# EAGLE design PaxGeo_MoBo (EAGLE 7.2.0)
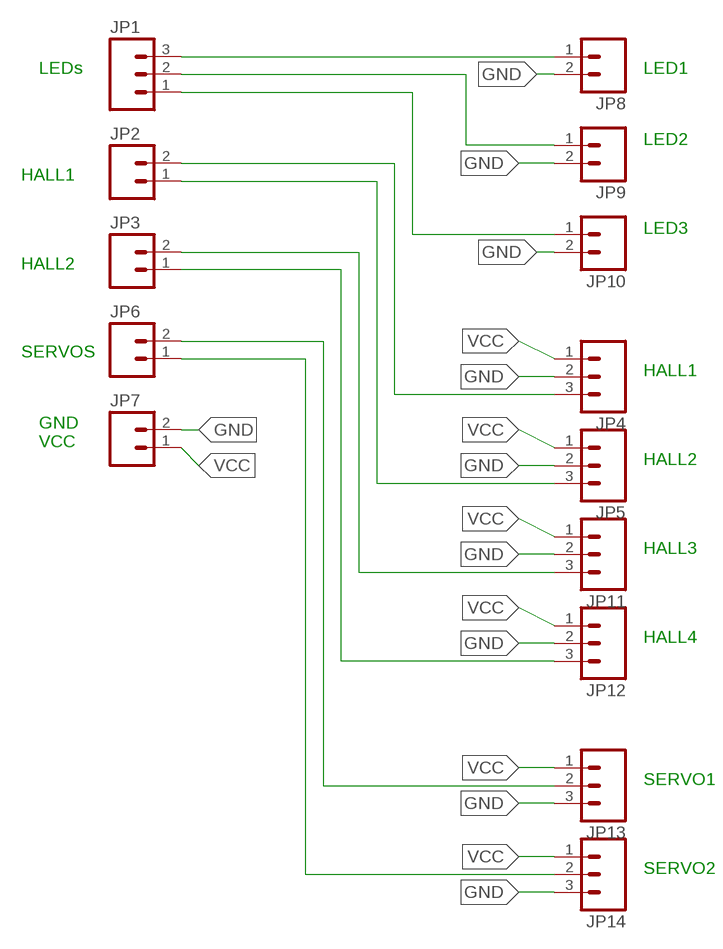
[diagram p0: schematic, sheet 1]

## Parts
JP1  M03SCREW  [SCREWTERMINAL-3.5MM-3]
JP2  M023.5MM  [SCREWTERMINAL-3.5MM-2]
JP3  M023.5MM  [SCREWTERMINAL-3.5MM-2]
JP4  M03SCREW  [SCREWTERMINAL-3.5MM-3]
JP5  M03SCREW  [SCREWTERMINAL-3.5MM-3]
JP6  M023.5MM  [SCREWTERMINAL-3.5MM-2]
JP7  M023.5MM  [SCREWTERMINAL-3.5MM-2]
JP8  M023.5MM  [SCREWTERMINAL-3.5MM-2]
JP9  M023.5MM  [SCREWTERMINAL-3.5MM-2]
JP10  M023.5MM  [SCREWTERMINAL-3.5MM-2]
JP11  M03SCREW  [SCREWTERMINAL-3.5MM-3]
JP12  M03SCREW  [SCREWTERMINAL-3.5MM-3]
JP13  M03SCREW  [SCREWTERMINAL-3.5MM-3]
JP14  M03SCREW  [SCREWTERMINAL-3.5MM-3]

## Nets
GND: JP4.2 JP5.2 JP7.2 JP8.2 JP9.2 JP10.2 JP11.2 JP12.2 JP13.3 JP14.3
N$1: JP1.3 JP8.1
N$2: JP1.2 JP9.1
N$3: JP1.1 JP10.1
N$4: JP2.2 JP4.3
N$5: JP2.1 JP5.3
N$6: JP3.2 JP11.3
N$7: JP3.1 JP12.3
N$8: JP6.2 JP13.2
N$9: JP6.1 JP14.2
VCC: JP4.1 JP5.1 JP7.1 JP11.1 JP12.1 JP13.1 JP14.1

## Notes on the sheet
- LEDs | LED1
- LED2
- HALL1
- LED3
- HALL2
- SERVOS | HALL1
- GND | VCC
- HALL2
- HALL3
- HALL4
- SERVO1
- SERVO2

## Library data of the parts
JP1 JP4 JP5 JP11-JP14 = SparkFun-Connectors:M03: Header 3 Standard 3-pin 0.1" header. Use with straight break away headers (SKU : PRT-00116), right angle break away headers (PRT-00553), swiss pins (PRT-00743), machine pins (PRT-00117), and female headers (PRT-00115). Molex polarized connector foot print use with SKU : PRT-08232 with associated crimp pins and housings.; PROD_ID: CONN-08288
JP2 JP3 JP6-JP10 = SparkFun-Connectors:M02: Standard 2-pin 0.1" header. Use with - straight break away headers ( PRT-00116) - right angle break away headers (PRT-00553) - swiss pins (PRT-00743) - machine pins (PRT-00117) - female headers (PRT-00115) Molex polarized connector foot print use with: PRT-08233 with associated crimp pins and housings. 2.54_SCREWTERM for use with PRT-10571. 3.5mm Screw Terminal footprints for PRT-08084 5mm Screw Terminal footprints for use with PRT-08432; PROD_ID: CONN-08399

## Board
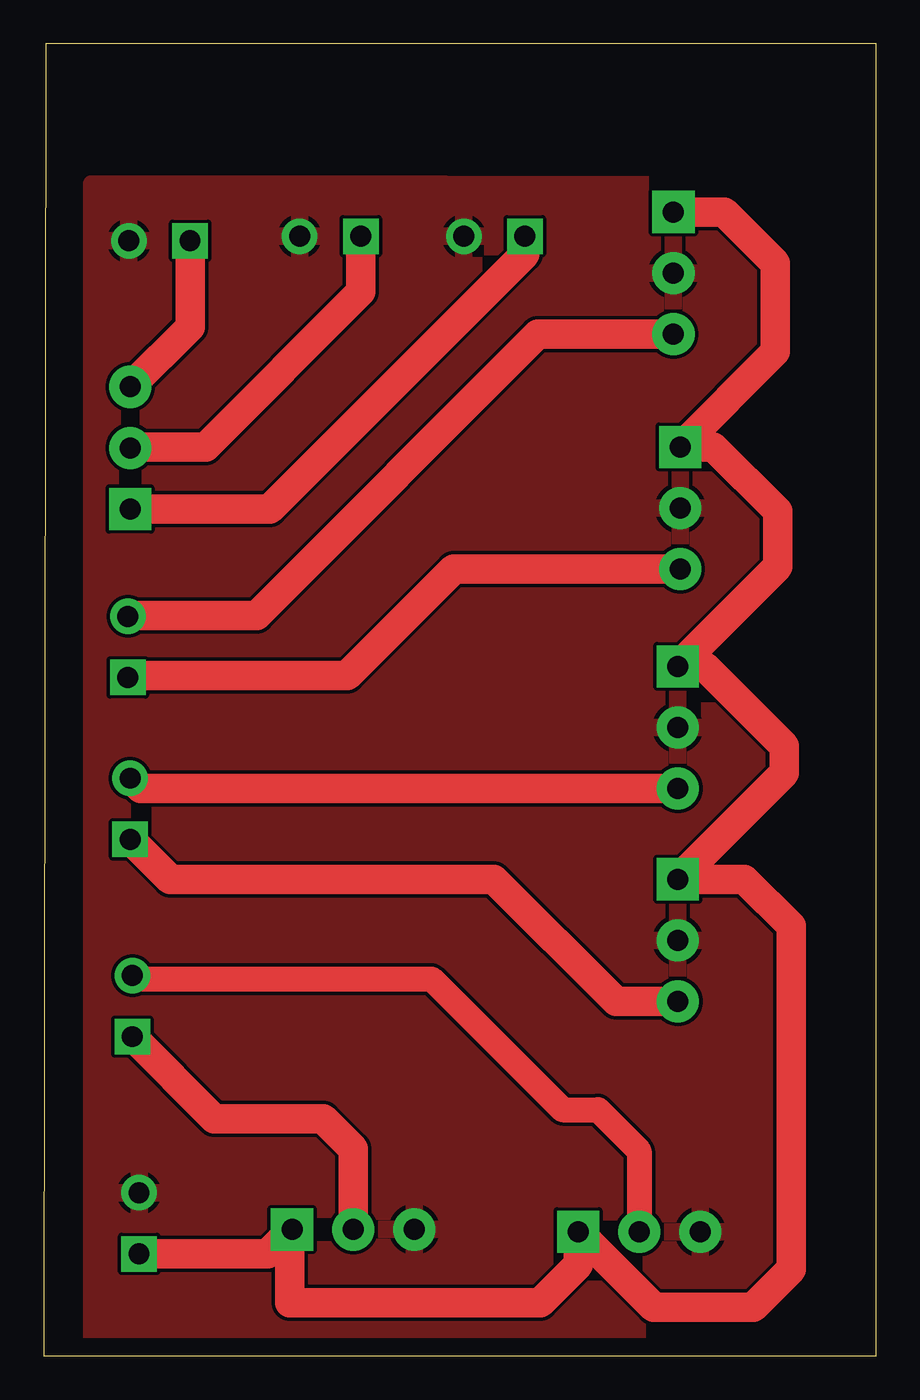
[diagram p1: board, top side]
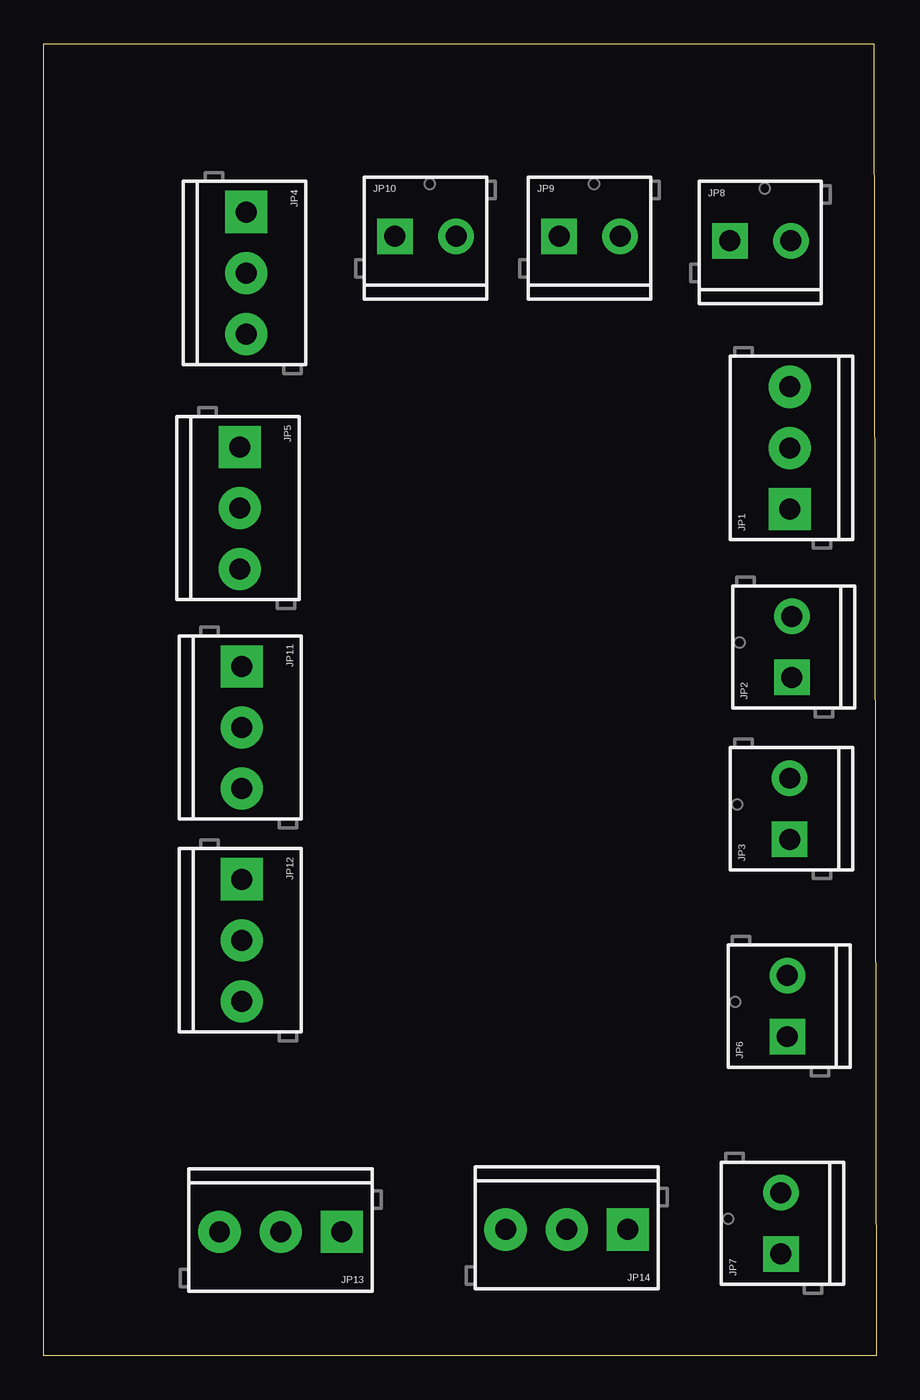
[diagram p2: board, bottom side, seen from below]

Size 47.68 x 75.17 mm. Coordinates in mm from the lower left corner, seen from the top.
Outline: 0,0 47.68,0 47.68,75.17 0.13,75.17 0,0
Copper layers (1*16): Top 0.035mm / dielectric 1.5mm / Bottom 0.035mm
Design rules "default": minimum track width 10mil, minimum drill 24mil, track to track 8mil, track to pad 8mil, pad to pad 8mil, via to via 8mil, smd to smd 8mil, copper to edge 40mil, drill to drill 8mil, minimum pad ring 10mil, minimum via ring 8mil, stop-mask expansion 4mil, vias tented up to drill 0mil, thermal gap 10mil

### Footprints (pad centres in the part's own frame; a part is rotated, then mirrored left to right if it is on the bottom)
SCREWTERMINAL-3.5MM-3 = drill 1.2 pad 2.413 square: 1 0,0 | drill 1.2 pad 2.413: 2 3.5,0; 3 7,0
SCREWTERMINAL-3.5MM-2 = drill 1.2 pad 2.032 square: 1 0,0 | drill 1.2 pad 2.032: 2 3.5,0

### Placement (x,y rotation side)
JP1  4.95,48.51 90 bottom
JP2  4.83,38.86 90 bottom
JP3  4.95,29.59 90 bottom
JP4  36.07,65.53 270 bottom
JP5  36.45,52.07 270 bottom
JP6  5.08,18.29 90 bottom
JP7  5.46,5.84 90 bottom
JP8  8.38,63.88 0 bottom
JP9  18.16,64.14 0 bottom
JP10  27.56,64.14 0 bottom
JP11  36.32,39.5 270 bottom
JP12  36.32,27.3 270 bottom
JP13  30.61,7.11 180 bottom
JP14  14.22,7.24 180 bottom

### Tracks (layer width: path | path; a pad name or v marks a point on that pad's centre or on a via)
GND
  Top 1.016: 38.23,7.11 JP13.3
  pour Top: 2.74,67.16 2.76,0.36 44.35,0.36 43.51,67.08
N$1
  Top 1.676: JP1.3 8.38,58.94 JP8.1
N$2
  Top 1.676: JP1.2 5.01,52.07 9.27,52.07 18.16,60.96 JP9.1
N$3
  Top 1.676: JP1.1 12.95,48.51 27.56,63.12 JP10.1
N$4
  Top 1.676: JP2.2 4.88,42.42 12.19,42.42 28.31,58.53 JP4.3
N$5
  Top 1.676: JP2.1 4.95,38.99 17.4,38.99 23.48,45.07 JP5.3
N$6
  Top 1.676: JP3.2 5.55,32.5 JP11.3
N$7
  Top 1.676: JP3.1 7.24,27.3 25.78,27.3 32.78,20.3 JP12.3
N$8
  Top 1.422: JP6.2 5.28,21.59 22.23,21.59 29.72,14.1 31.75,14.1 34.11,11.74 JP13.2
N$9
  Top 1.676: JP6.1 9.78,13.59 16,13.59 17.72,11.87 JP14.2
VCC
  Top 1.676: JP7.1 12.83,5.84 JP14.1 14.1,7.11 14.1,3.05 28.45,3.05 30.61,5.21 JP13.1 34.92,2.79 40.64,2.79 42.8,4.95 42.8,24.64 40.13,27.3 JP12.1 42.42,33.4 42.42,34.92 37.85,39.5 JP11.1 42.04,45.21 42.04,48.39 38.35,52.07 JP5.1 41.91,57.53 41.91,62.61 38.99,65.53 JP4.1